# Altium schematic sheet Main.SchDoc
size A3
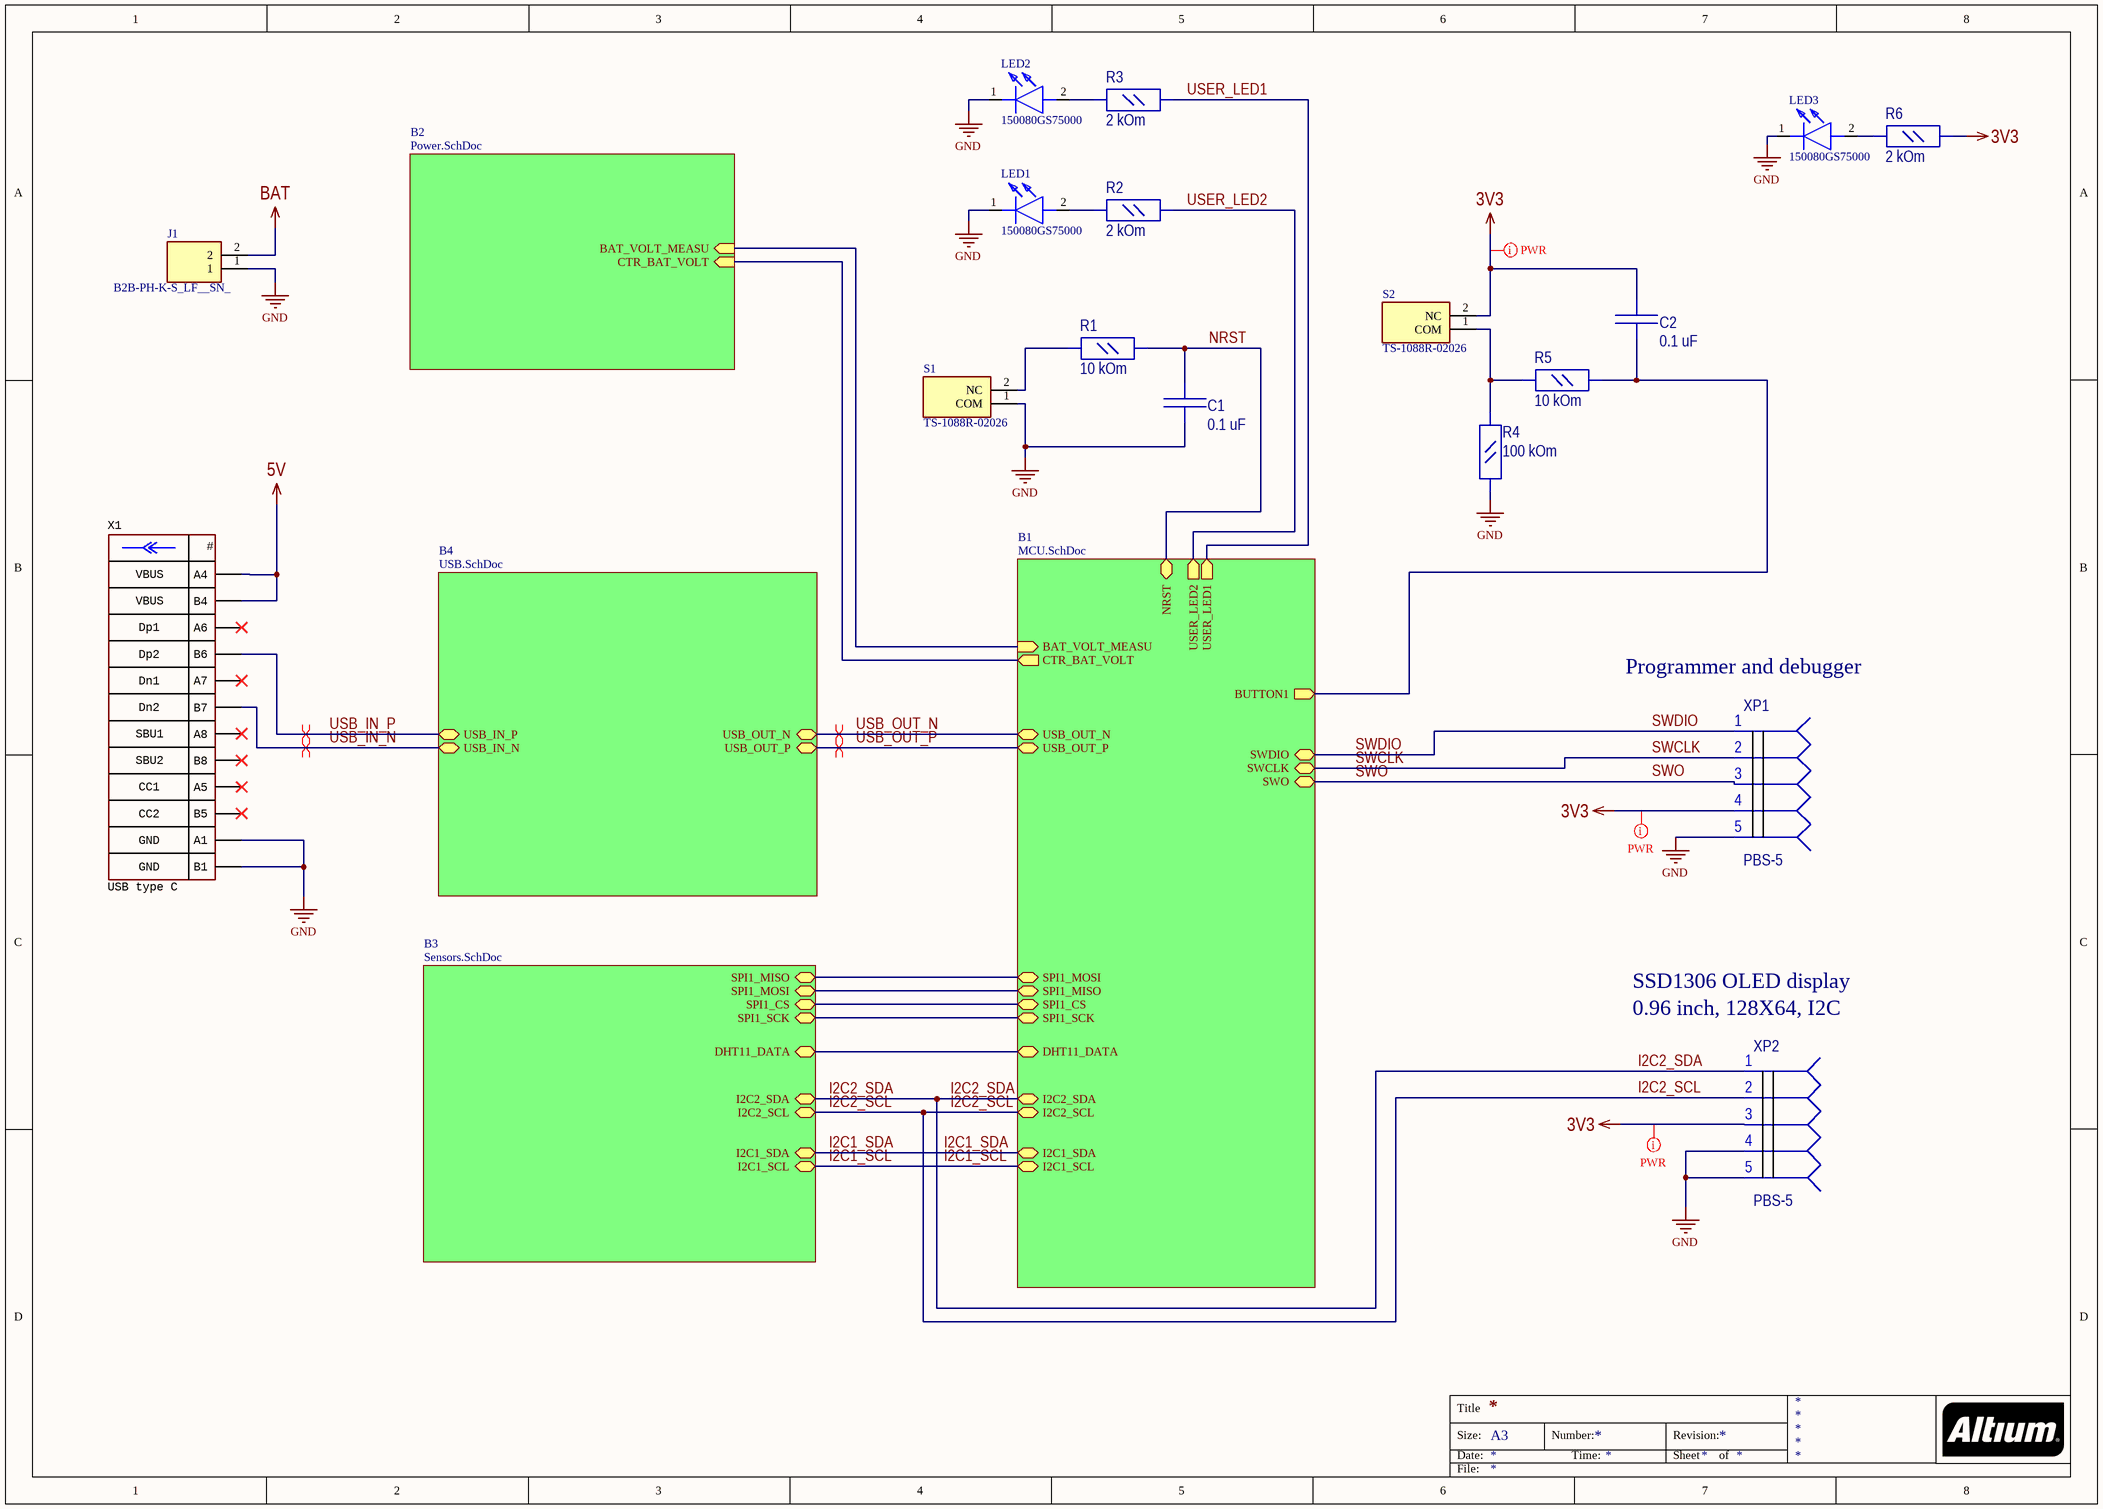
[diagram p0: Main.SchDoc]

## Parts
C1  0.1 uF  [C_0805]
C2  0.1 uF  [C_0805]
J1  B2B-PH-K-S_LF__SN_  [SHDR2W50P0X200_1X2_590X450X600P]
LED1  150080GS75000  [LEDM2012X80N]
LED2  150080GS75000  [LEDM2012X80N]
LED3  150080GS75000  [LEDM2012X80N]
R1  10 kOm  [R_0805]
R2  2 kOm  [R_0805]
R3  2 kOm  [R_0805]
R4  100 kOm  [R_0805]
R5  10 kOm  [R_0805]
R6  2 kOm  [R_0805]
S1  TS-1088R-02026  [TS1088R02026]
S2  TS-1088R-02026  [TS1088R02026]
X1  CommentText: USB type C  [CON: TYPE-C-31-M-12]
XP1  PBS-5  [PBS-5]
XP2  PBS-5  [PBS-5]

## Sub-sheets
B1 = MCU.SchDoc: I2C2_SDA (bidir), SWCLK (bidir), SPI1_SCK (bidir), I2C1_SCL (bidir), BAT_VOLT_MEASU (in), NRST (bidir), SPI1_MOSI (bidir), BUTTON1 (out), SWDIO (bidir), USER_LED2 (out), USER_LED1 (out), SPI1_MISO (bidir), CTR_BAT_VOLT (out), SWO (bidir), I2C2_SCL (bidir), SPI1_CS (bidir), I2C1_SDA (bidir), DHT11_DATA (bidir), USB_OUT_N (bidir), USB_OUT_P (bidir)
B2 = Power.SchDoc: BAT_VOLT_MEASU (in), CTR_BAT_VOLT (in)
B3 = Sensors.SchDoc: I2C1_SCL (bidir), I2C1_SDA (bidir), DHT11_DATA (bidir), I2C2_SCL (bidir), I2C2_SDA (bidir), SPI1_MOSI (bidir), SPI1_SCK (bidir), SPI1_CS (bidir), SPI1_MISO (bidir)
B4 = USB.SchDoc: USB_OUT_N (bidir), USB_OUT_P (bidir), USB_IN_P (bidir), USB_IN_N (bidir)

## Nets
3V3: C2.2 R6.1 S2.2(NC) XP1.4 XP2.3
5V: X1.A4 X1.B4
BAT: J1.2
GND: C1.1 J1.1 LED1.1(K) LED2.1(K) LED3.1(K) R4.2 S1.1(COM) X1.A1 X1.B1 XP1.5 XP2.4 XP2.5
I2C1_SCL: sheet B1/I2C1_SCL, sheet B3/I2C1_SCL
I2C1_SDA: sheet B1/I2C1_SDA, sheet B3/I2C1_SDA
I2C2_SCL: XP2.2 ; sheet B1/I2C2_SCL, sheet B3/I2C2_SCL
I2C2_SDA: XP2.1 ; sheet B1/I2C2_SDA, sheet B3/I2C2_SDA
NRST: C1.2 R1.1 ; sheet B1/NRST
SWCLK: XP1.2 ; sheet B1/SWCLK
SWDIO: XP1.1 ; sheet B1/SWDIO
SWO: XP1.3 ; sheet B1/SWO
USB_IN_N: X1.B7 ; sheet B4/USB_IN_N
USB_IN_P: X1.B6 ; sheet B4/USB_IN_P
USB_OUT_N: sheet B1/USB_OUT_N, sheet B4/USB_OUT_N
USB_OUT_P: sheet B1/USB_OUT_P, sheet B4/USB_OUT_P
USER_LED1: R3.1 ; sheet B1/USER_LED1
USER_LED2: R2.1 ; sheet B1/USER_LED2
NetC2_1: C2.1 R5.1 ; sheet B1/BUTTON1
NetLED1_2: LED1.2(A) R2.2
NetLED2_2: LED2.2(A) R3.2
NetLED3_2: LED3.2(A) R6.2
NetR1_2: R1.2 S1.2(NC)
NetR4_1: R4.1 R5.2 S2.1(COM)
(unnamed): sheet B1/SPI1_SCK, sheet B3/SPI1_SCK
(unnamed): sheet B1/BAT_VOLT_MEASU, sheet B2/BAT_VOLT_MEASU
(unnamed): sheet B1/SPI1_MOSI, sheet B3/SPI1_MISO
(unnamed): sheet B1/SPI1_MISO, sheet B3/SPI1_MOSI
(unnamed): sheet B1/CTR_BAT_VOLT, sheet B2/CTR_BAT_VOLT
(unnamed): sheet B1/SPI1_CS, sheet B3/SPI1_CS
(unnamed): sheet B1/DHT11_DATA, sheet B3/DHT11_DATA

Not connected (* = marked no-connect by the designer): X1 A5* A6* A7* A8* B5* B8*

## Layout directives
net class PWR: 3V3
differential pair: USB_IN_N, USB_IN_P, USB_OUT_N, USB_OUT_P

## Notes on the sheet
- (near XP1) Programmer and debugger
- SSD1306 OLED display
- (near XP2) 0.96 inch, 128X64, I2C
- Title
- Size:
- Date:
- A3
- Number:
- Time:
- Revision:
- Sheet
- of
- File:
- (in symbol Connector_USB_Type_C) #; VBUS; Dp1; Dp2; Dn1; Dn2; SBU1; SBU2; CC1; CC2; GND

## Library data of the parts
C1 C2 = C_0805: Value: 100nF
J1 = B2B-PH-K-S_LF__SN_: Connector; Manufacturer_Name: JST (JAPAN SOLDERLESS TERMINALS); Manufacturer_Part_Number: B2B-PH-K-S(LF)(SN); Datasheet Link: https://datasheet.lcsc.com/szlcsc/JST-Sales-America-B2B-PH-K-S-LF-SN_C131337.pdf; Height: 6mm; Arrow Part Number: B2B-PH-K-S(LF)(SN); Arrow Price/Stock: https://www.arrow.com/en/products/b2b-ph-k-s-lf-sn/jst-manufacturing
LED1-LED3 = 150080GS75000: LED; Manufacturer_Name: Wurth Elektronik; Datasheet Link: https://katalog.we-online.com/led/datasheet/150080GS75000.pdf; Height: 0.8mm; Manufacturer_Part_Number: 150080GS75000; Mouser Part Number: 710-150080GS75000; Mouser Price/Stock: https://www.mouser.co.uk/ProductDetail/Wurth-Elektronik/150080GS75000?qs=2kOmHSv6VfQRoTEZVk1mGA%3D%3D
R1 R5 R6 = R_0805
  R1 R5: Value: 10 kOm
  R6: Value: 2 kOm
R2 R3 = R_0805: Value: 510 Om
R4 = R_0805: Value: 10 kOm
S1 S2 = TS-1088R-02026: Switch; Manufacturer_Name: XUNPU; Datasheet Link: https://datasheet.lcsc.com/szlcsc/1912111437_XUNPU-TS-1088R-02026_C455280.pdf; Height: 2.2mm; Manufacturer_Part_Number: TS-1088R-02026
X1 = Connector_USB_Type_C: Manufacturer: Korean Hroparts; ValueManufacturerPartNumber: USB Type C, 3A; PartNumber: TYPE-C-31-M-12; CurrentMax: 3A; HelpURL: https://lcsc.com/product-detail/USB-Type-C_Korean-Hroparts-Elec-TYPE-C-31-M-12_C165948.html; TypeConnector: USB Type C